# EAGLE design MICROCONTROLLER BOARD (EAGLE 9.6.2)
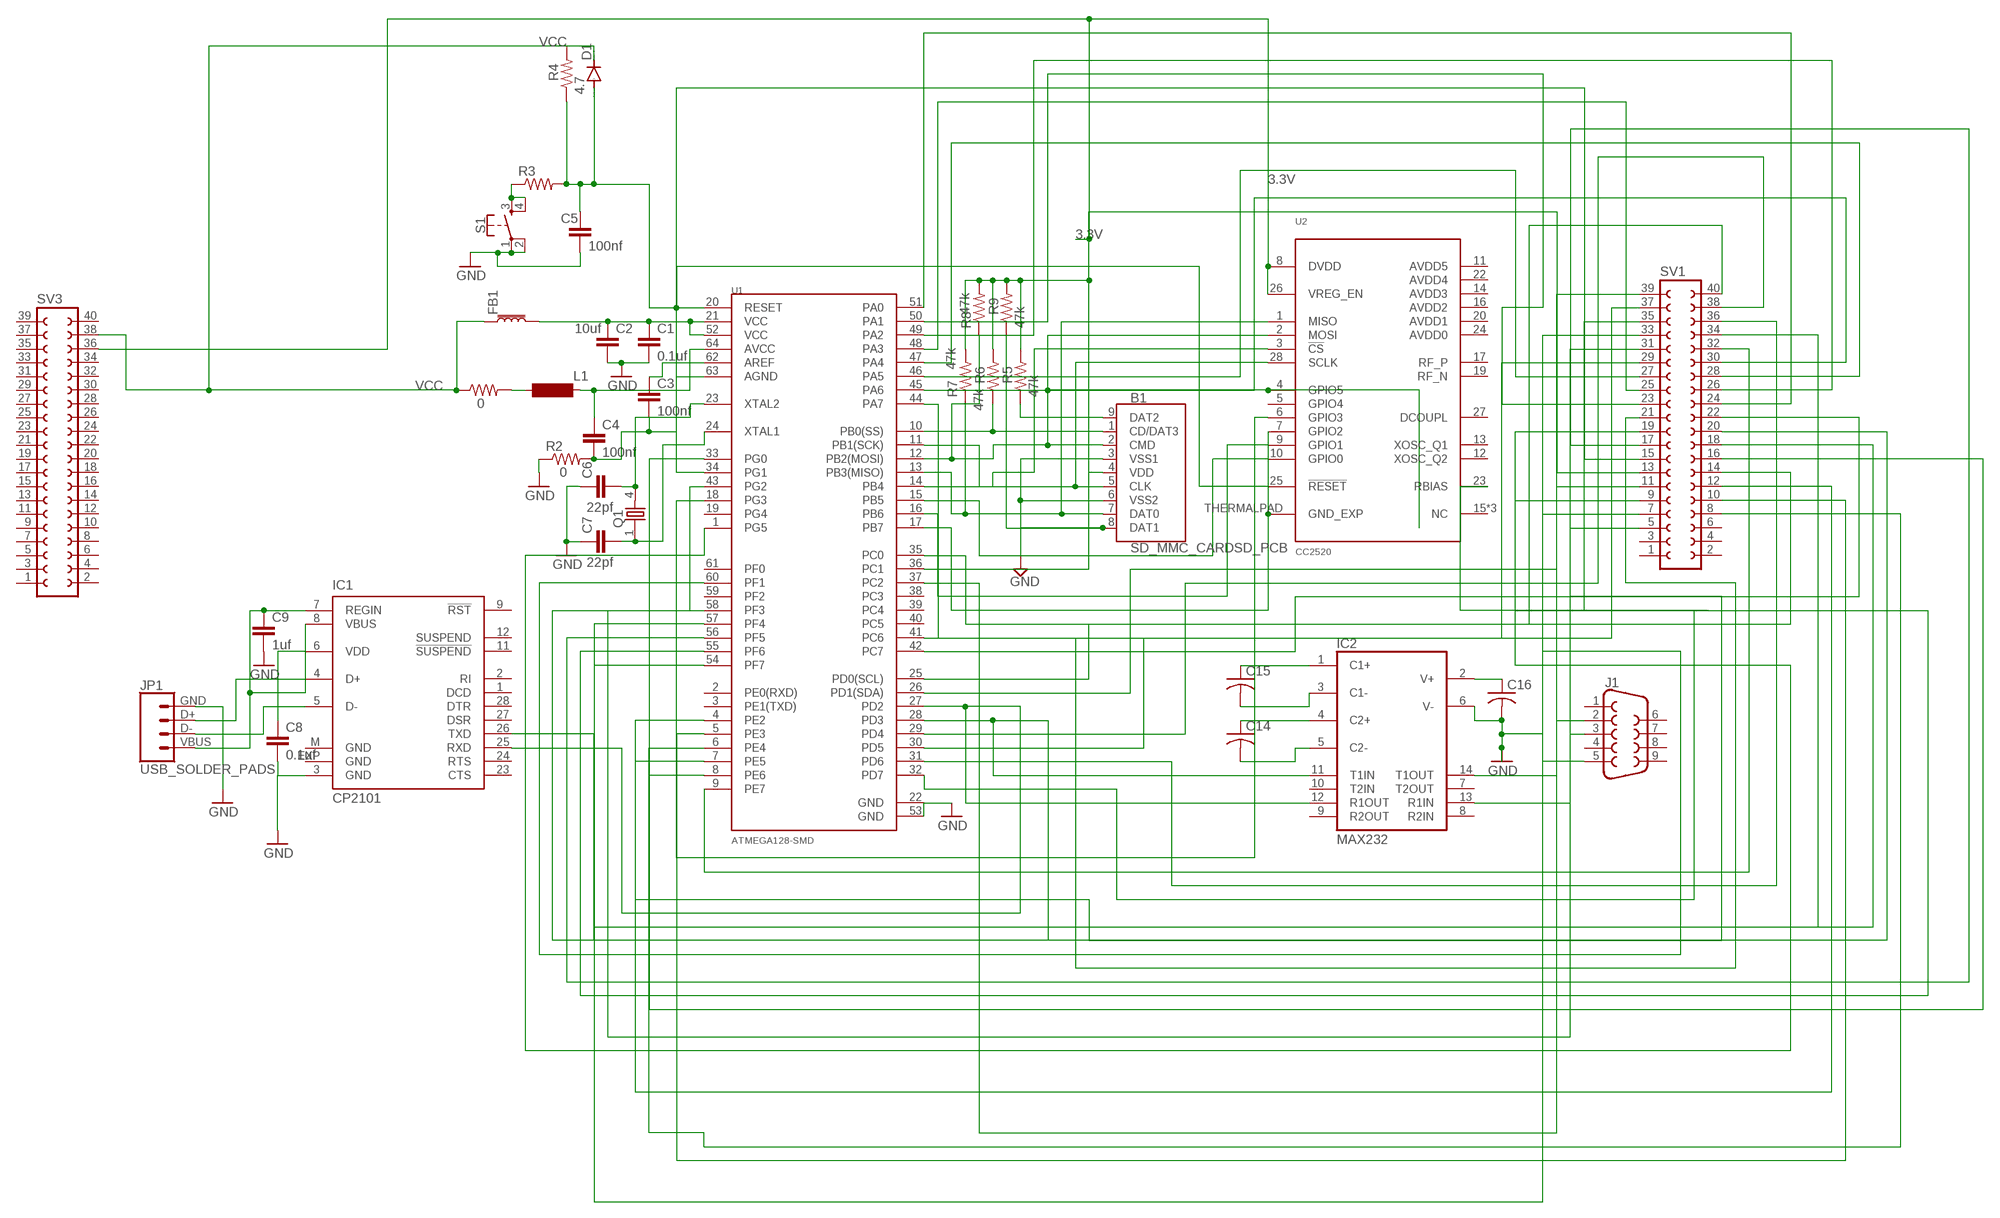
[diagram p0: schematic, sheet 1]

## Parts
B1  SD_MMC_CARDSD_PCB  [SD-MMC-CARD]
C1  0.1uf  C-EU025-024X044  [C025-024X044]
C2  10uf  C-EU025-024X044  [C025-024X044]
C3  100nf  C-EU025-024X044  [C025-024X044]
C4  100nf  C-EU025-024X044  [C025-024X044]
C5  100nf  C-EU025-024X044  [C025-024X044]
C6  22pf  C-EU025-024X044  [C025-024X044]
C7  22pf  C-EU025-024X044  [C025-024X044]
C8  0.1uf  C-EU025-024X044  [C025-024X044]
C9  1uf  C-EU025-024X044  [C025-024X044]
C14  C-US025-024X044  [C025-024X044]
C15  C-US025-024X044  [C025-024X044]
C16  C-US025-024X044  [C025-024X044]
D1  1N4004  [DO41-10]
FB1  FERRITE_BEAD-120_OHM-0402T  [0402-TIGHT]
IC1  CP2101  [MLP28]
IC2  MAX232  [DIL16]
J1  DB9FEMALE  [DB9]
JP1  USB_SOLDER_PADS  [USB-SOLDER-PADS]
L1  BS11  [BS11]
Q1  86SMX  [86SMX]
R1  0  R-US_0204/2V  [0204V]
R2  0  R-US_0204/2V  [0204V]
R3  R-US_0204/2V  [0204V]
R4  4.7  R-US_0204/2V  [0204V]
R5  47k  R-US_0204/2V  [0204V]
R6  47k  R-US_0204/2V  [0204V]
R7  47k  R-US_0204/2V  [0204V]
R8  47k  R-US_0204/2V  [0204V]
R9  47k  R-US_0204/2V  [0204V]
S1  MOMENTARY-SWITCH-SPST-2-SMD-4.6X2.8MM  [TACTILE_SWITCH_SMD_4.6X2.8MM]
SV1  FE20-2  [FE20-2]
SV3  FE20-2  [FE20-2]
U1  ATMEGA128-SMD  [TQFP64_14X14MM]
U2  CC2520  [S-PVQFN-N28]

## Nets
3.3V: B1.4(VDD) R5.2 R6.2 R7.2 R8.2 R9.2 SV3.36 U2.8(DVDD) U2.26(VREG_EN)
GND: B1.3(VSS1) B1.6(VSS2) C1.2 C2.2 C5.2 C6.1 C7.1 C8.2 C9.2 C16.2 IC1.3(GND) IC2.6(V-) J1.5 JP1.GND R2.1 S1.1 S1.2 U1.22(GND) U1.53(GND)
N$1: C1.1 C2.1 FB1.2 U1.21(VCC) U1.52(VCC)
N$2: L1.1 R1.2
N$3: C4.1 L1.2 U1.64(AVCC)
N$4: C3.1 U1.62(AREF)
N$5: C3.2 C4.2 R2.2 U1.63(AGND)
N$6: SV1.18 U1.54(PF7)
N$7: R3.1 S1.3 S1.4
N$8: C5.1 D1.A R3.2 R4.1 U1.20(RESET) U2.25(!RESET)
N$9: B1.8(DAT1) R9.1
N$10: SV1.40 U1.25(PD0(SCL))
N$11: C7.2 Q1.1 U1.24(XTAL1)
N$12: B1.7(DAT0) R7.1 U1.13(PB3(MISO)) U2.1(MISO)
N$13: B1.5(CLK) U1.11(PB1(SCK)) U2.28(SCLK)
N$14: B1.2(CMD) R8.1 U1.12(PB2(MOSI)) U2.2(MOSI) U2.4(GPIO5)
N$15: U1.16(PB6) U2.9(GPIO1)
N$16: B1.9(DAT2) R5.1
N$18: SV1.39 U1.26(PD1(SDA))
N$19: B1.1(CD/DAT3) R6.1 U1.10(PB0(SS))
N$20: U1.14(PB4) U2.3(!CS)
N$21: U1.15(PB5) U2.10(GPIO0)
N$22: U1.17(PB7) U2.7(GPIO2) U2.THERMALPAD(GND_EXP)
N$23: U1.18(PG3) U2.6(GPIO3)
N$24: SV1.38 U1.29(PD4)
N$25: SV1.37 U1.30(PD5)
N$26: IC1.26(TXD) IC2.11(T1IN) U1.28(PD3)
N$27: IC1.25(RXD) IC2.12(R1OUT) U1.27(PD2)
N$28: C9.1 IC1.7(REGIN) IC1.8(VBUS) JP1.VBUS
N$29: C15.1 IC2.1(C1+)
N$30: IC1.4(D+) JP1.D+
N$31: IC1.5(D-) JP1.D-
N$32: C15.2 IC2.3(C1-)
N$33: C8.1 IC1.6(VDD)
N$34: C14.1 IC2.4(C2+)
N$35: C14.2 IC2.5(C2-)
N$36: C16.1 IC2.2(V+)
N$37: SV1.36 U1.31(PD6)
N$38: IC2.14(T1OUT) J1.2
N$39: IC2.13(R1IN) J1.3
N$40: SV1.35 U1.32(PD7)
N$41: SV1.33 U1.60(PF1)
N$42: SV1.34 U1.8(PE6)
N$43: SV1.31 U1.7(PE5)
N$44: SV1.32 U1.9(PE7)
N$45: SV1.29 U1.44(PA7)
N$46: SV1.30 U1.45(PA6)
N$47: SV1.27 U1.46(PA5)
N$48: SV1.28 U1.47(PA4)
N$49: SV1.25 U1.48(PA3)
N$50: SV1.26 U1.49(PA2)
N$51: SV1.23 U1.50(PA1)
N$52: SV1.24 U1.51(PA0)
N$53: SV1.21 U1.41(PC6)
N$54: SV1.22 U1.42(PC7)
N$55: SV1.20 U1.43(PG2)
N$56: C6.2 Q1.4 U1.23(XTAL2)
N$57: SV1.16 U1.33(PG0)
N$58: SV1.17 U1.56(PF5)
N$59: SV1.19 U1.55(PF6)
N$60: SV1.15 U1.34(PG1)
N$61: SV1.14 U1.35(PC0)
N$62: SV1.13 U1.36(PC1)
N$63: U2.23(RBIAS)
N$64: SV1.9 U1.1(PG5)
N$65: SV1.12 U1.4(PE2)
N$66: SV1.10 U1.5(PE3)
N$67: SV1.11 U1.37(PC2)
N$68: SV1.7 U1.57(PF4)
N$69: SV1.5 U1.58(PF3)
N$70: SV1.8 U1.6(PE4)
VCC: D1.C FB1.1 R1.1 R4.2 SV3.38
Unconnected: IC1.1(DCD) IC1.2(RI) IC1.9(!RST) IC1.11(!SUSPEND) IC1.12(SUSPEND) IC1.23(CTS) IC1.24(RTS) IC1.27(DSR) IC1.28(DTR) IC2.7(T2OUT) IC2.8(R2IN) IC2.9(R2OUT) IC2.10(T2IN) J1.1 J1.4 J1.6 J1.7 J1.8 J1.9 SV1.1 SV1.2 SV1.3 SV1.4 SV1.6 SV3.1 SV3.2 SV3.3 SV3.4 SV3.5 SV3.6 SV3.7 SV3.8 SV3.9 SV3.10 SV3.11 SV3.12 SV3.13 SV3.14 SV3.15 SV3.16 SV3.17 SV3.18 SV3.19 SV3.20 SV3.21 SV3.22 SV3.23 SV3.24 SV3.25 SV3.26 SV3.27 SV3.28 SV3.29 SV3.30 SV3.31 SV3.32 SV3.33 SV3.34 SV3.35 SV3.37 SV3.39 SV3.40 U1.2(PE0(RXD)) U1.3(PE1(TXD)) U1.19(PG4) U1.38(PC3) U1.39(PC4) U1.40(PC5) U1.59(PF2) U1.61(PF0) U2.5(GPIO4) U2.11(AVDD5) U2.12(XOSC_Q2) U2.13(XOSC_Q1) U2.14(AVDD3) U2.15(NC) U2.16(AVDD2) U2.17(RF_P) U2.18(NC) U2.19(RF_N) U2.20(AVDD1) U2.21(NC) U2.22(AVDD4) U2.24(AVDD0) U2.27(DCOUPL)

## Power pins joined to a net without a drawn wire
GND: IC1.EXP(GND) IC1.M(GND) IC2.15(GND)
VCC: IC2.16(VCC)

## Library data of the parts
B1 = SparkFun-Boards:SD_MMC_CARD: SD MMC Card Footprint Mechanical footprint with connectors of an SD/MMC card- NOT a socket! SparkFun Products: Electric Imp <https://www.sparkfun.com/products/11395> microSD Card with SD adapter <https://www.sparkfun.com/products/13833>
C1-C9 = rcl:C-EU: CAPACITOR, European symbol; SPICEPREFIX: C
C14-C16 = rcl:C-US: CAPACITOR, American symbol; SPICEPREFIX: C
D1 = diode:1N4004: DIODE general purpose rectifier, 1 A
FB1 = SparkFun-Coils:FERRITE_BEAD-120_OHM: Ferrite Bead (blocks, cores, rings, chokes, etc.) Inductor with layers of ferrite used to suppress high frequencies. Often used to isolate high frequency noise.; PROD_ID: NDUC-14206
IC1 = silabs:CP210*: Single-Chip USB to UART Bridge Source: www.silabs.com .. CP2101.pdf / cp2102.pdf; MF: FARNELL; MPN: CP2102-GM; OC_FARNELL: 9282130; OC_NEWARK: 30K5635
IC2 = maxim:MAX232: RS232 TRANSCEIVER; MF: MAXIM; MPN: MAX232ACPE+; OC_FARNELL: 9723773; OC_NEWARK: 68K4544
J1 = SparkFun-Connectors:DB9: DB9 Connector Standard DB9 (D-Sub 9) serial connector. Can be used for CAN bus as well as RS485 and RS232. Footprint production proven. Here is the female version connector we sell at SparkFun: 9 Pin Female Serial Connector - PCB Mount <https://www.sparkfun.com/products/429> (PRT-00429) This connector has been used on the following SparkFun products: SparkFun RS232 Shifter - SMD <https://www.sparkfun.com/products/449> (PRT-00449) SparkFun RS232 Shifter SMD (No DB9) <https://www.sparkfun.com/products/8780> (PRT-08780); PROD_ID: CONN-08194
JP1 = SparkFun-Connectors:USB_SOLDER_PADS: Solder pad access to USB pins. Helpful to expose on PCBs so user can attach external USB connector if necessary.
L1 = inductor-neosid:BS: INDUCTOR nominal inductance, magnetically screened; OC_FARNELL: unknown; OC_NEWARK: unknown
Q1 = crystal:86SMX: CRYSTAL; MF: C-MAC FREQUENCY PRODUCTS LTD; MPN: XTAL003321- 86SMX; OC_FARNELL: 6344914; OC_NEWARK: 01H9866
R1-R9 = rcl:R-US_: RESISTOR, American symbol; SPICEPREFIX: R
S1 = SparkFun-Switches:MOMENTARY-SWITCH-SPST-2: Momentary Switch (Pushbutton) - SPST - Two Circuits Normally-open (NO) SPST momentary switches (buttons, pushbuttons). Schematic symbol includes two switch circuits. Variants SMD-4.6MMX2.8MM - 4.60mm x 2.80mm Tactile Momentary Button Switch - Used on SparkFun SAMD21 Mini Breakout <https://www.sparkfun.com/products/13664> SMD-5.2MM - Mini Pushbutton Switch - SMD <https://www.sparkfun.com/products/8720> - Used on Arduino Pro Mini <https://www.sparkfun.com/products/11114>; PROD_ID: SWCH-13065
SV1 SV3 = con-lsta:FE20-2: FEMALE HEADER; OC_FARNELL: unknown; OC_NEWARK: unknown
U1 = SparkFun-IC-Microcontroller:ATMEGA128: ATmega 128 ATmega128/128L/1281/2561. Note: The ATmega128 pin 1 is PEN and the ATmega256/1281 pin 1 is PG5. Not in catalog
U2 = CC2520:CC2520: 2.4 GHZ IEEE 802.15.4/ZIGBEE® RF TRANSCEIVER; AVAILABILITY: Unavailable; DESCRIPTION: IC RF TxRx + MCU 802.15.4 Zigbee® 2.4GHz 28-VFQFN Exposed Pad; MF: Texas Instruments; MP: CC2520; PACKAGE: VQFN-28 Texas Instruments; PRICE: None

## Board
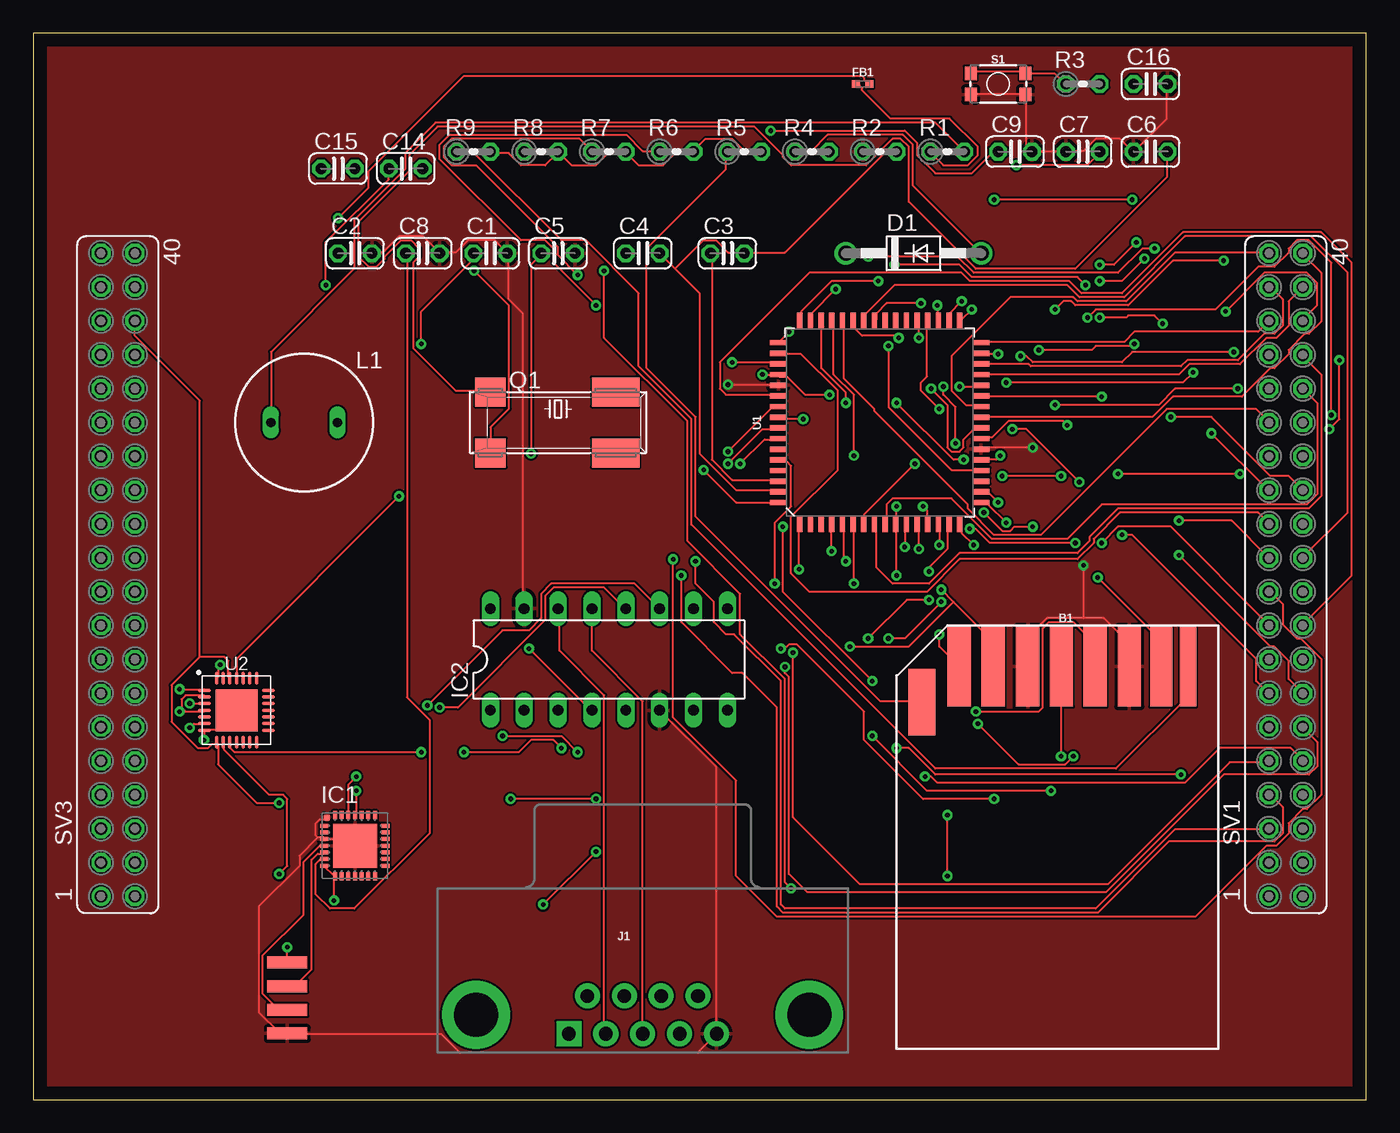
[diagram p1: board, top side]
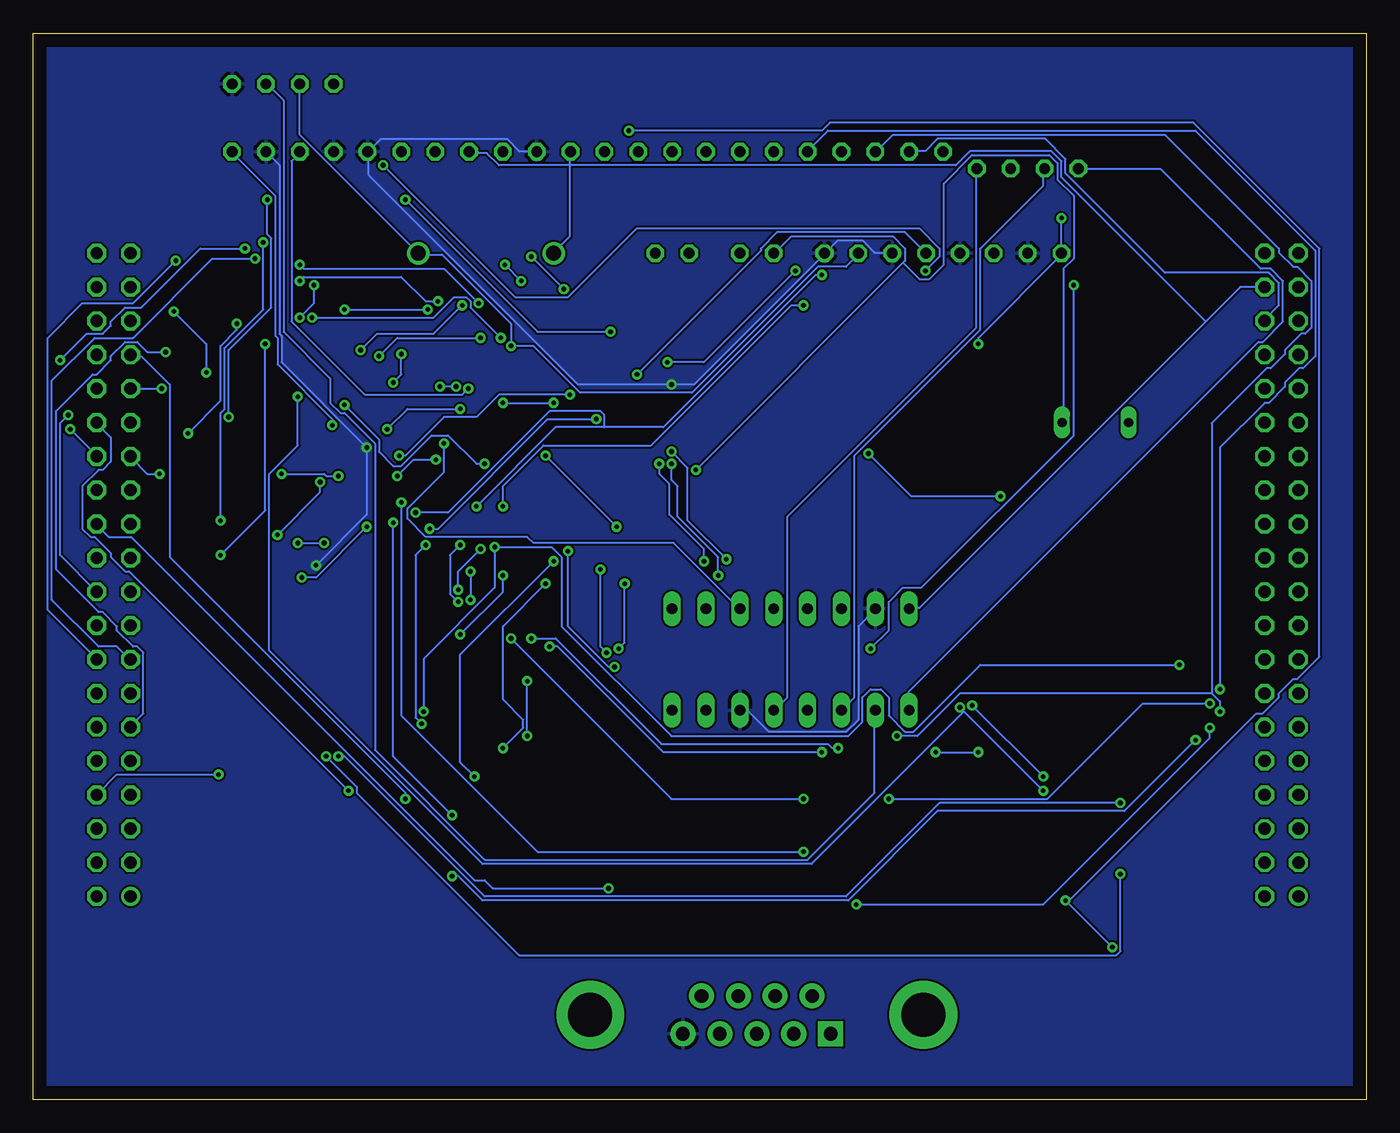
[diagram p2: board, bottom side, seen from below]

Size 100 x 80 mm. Coordinates in mm from the lower left corner, seen from the top.
Outline: 0,0 100,0 100,80 0,80 0,0
Copper layers (1*16): Top 0.035mm / dielectric 1.5mm / Bottom 0.035mm
Design rules "default": minimum track width 6mil, minimum drill 0.35mm, track to track 6mil, track to pad 6mil, pad to pad 6mil, via to via 6mil, smd to smd 6mil, copper to edge 40mil, drill to drill 6mil, minimum pad ring 10mil, minimum via ring 8mil, stop-mask expansion 4mil, vias tented up to drill 0mil, thermal gap 10mil

### Footprints (pad centres in the part's own frame; a part is rotated, then mirrored left to right if it is on the bottom)
SD-MMC-CARD = smd 1.75 x 6: 1 -8.015,14.713; 2 -5.465,14.703; 3 -2.87,14.703; 4 -0.34,14.703; 5 2.195,14.703; 6 4.76,14.703 | smd 1.65 x 6: 7 7.16,14.703 | smd 1.25 x 6: 8 9.16,14.703 | smd 2 x 5: 9 -10.8,12.03
C025-024X044 = drill 0.813 octagon: 1 -1.27,0; 2 1.27,0
DO41-10 = drill 1.118: A 5.08,0; C -5.08,0
0402-TIGHT = smd 0.6 x 0.6: 1 -0.5,0; 2 0.5,0
MLP28 = smd 0.6 x 0.3: 1 -2.3,1.5; 2 -2.3,1; 3 -2.3,0.5; 4 -2.3,0; 5 -2.3,-0.5; 6 -2.3,-1; 7 -2.3,-1.5; 15 2.3,-1.5; 16 2.3,-1; 17 2.3,-0.5; 18 2.3,0; 19 2.3,0.5; 20 2.3,1; 21 2.3,1.5 | smd 0.3 x 0.6: 8 -1.5,-2.3; 9 -1,-2.3; 10 -0.5,-2.3; 11 0,-2.3; 12 0.5,-2.3; 13 1,-2.3; 14 1.5,-2.3; 22 1.5,2.3; 23 1,2.3; 24 0.5,2.3; 25 0,2.3; 26 -0.5,2.3; 27 -1,2.3; 28 -1.5,2.3 | smd 3.3 x 3.3: EXP 0,0 | smd 0.435 x 0.435: M -2.103,2.103
DIL16 = drill 0.813 long: 1 -8.89,-3.81; 2 -6.35,-3.81; 3 -3.81,-3.81; 4 -1.27,-3.81; 5 1.27,-3.81; 6 3.81,-3.81; 7 6.35,-3.81; 8 8.89,-3.81; 9 8.89,3.81; 10 6.35,3.81; 11 3.81,3.81; 12 1.27,3.81; 13 -1.27,3.81; 14 -3.81,3.81; 15 -6.35,3.81; 16 -8.89,3.81
DB9 = drill 1.016 pad 1.88 square: 1 -5.54,-1.42 | drill 1.016 pad 1.88: 2 -2.77,-1.42; 3 0,-1.42; 4 2.77,-1.42; 5 5.54,-1.42; 6 -4.15,1.42; 7 -1.38,1.42; 8 1.38,1.42; 9 4.15,1.42 | drill 3.302 pad 5.08: G1 -12.5,0; G2 12.5,0
USB-SOLDER-PADS = smd 3 x 0.9: D+ 0,-0.889; D- 0,0.889; GND 0,-2.667; VBUS 0,2.667
BS11 = drill 0.7 long: 1 -2.5,0; 2 2.5,0
86SMX = smd 2.286 x 2.184: 1 -5.08,-2.286; 4 -5.08,2.286 | smd 3.556 x 2.184: 2 4.318,-2.286; 3 4.318,2.286
0204V = drill 0.813 octagon: 1 -1.27,0; 2 1.27,0
TACTILE_SWITCH_SMD_4.6X2.8MM = smd 0.9 x 1: 1 -2.05,-0.8; 2 2.05,-0.8; 3 2.05,0.8; 4 -2.05,0.8
FE20-2 = drill 0.914: 1 -24.13,1.27 | drill 0.914 octagon: 2 -24.13,-1.27; 3 -21.59,1.27; 4 -21.59,-1.27; 5 -19.05,1.27; 6 -19.05,-1.27; 7 -16.51,1.27; 8 -16.51,-1.27; 9 -13.97,1.27; 10 -13.97,-1.27; 11 -11.43,1.27; 12 -11.43,-1.27; 13 -8.89,1.27; 14 -8.89,-1.27; 15 -6.35,1.27; 16 -6.35,-1.27; 17 -3.81,1.27; 18 -3.81,-1.27; 19 -1.27,1.27; 20 -1.27,-1.27; 21 1.27,1.27; 22 1.27,-1.27; 23 3.81,1.27; 24 3.81,-1.27; 25 6.35,1.27; 26 6.35,-1.27; 27 8.89,1.27; 28 8.89,-1.27; 29 11.43,1.27; 30 11.43,-1.27; 31 13.97,1.27; 32 13.97,-1.27; 33 16.51,1.27; 34 16.51,-1.27; 35 19.05,1.27; 36 19.05,-1.27; 37 21.59,1.27; 38 21.59,-1.27; 39 24.13,1.27; 40 24.13,-1.27
TQFP64_14X14MM = smd 0.4 x 1.27: 1 -6,-7.6; 2 -5.2,-7.6; 3 -4.4,-7.6; 4 -3.6,-7.6; 5 -2.8,-7.6; 6 -2,-7.6; 7 -1.2,-7.6; 8 -0.4,-7.6; 9 0.4,-7.6; 10 1.2,-7.6; 11 2,-7.6; 12 2.8,-7.6; 13 3.6,-7.6; 14 4.4,-7.6; 15 5.2,-7.6; 16 6,-7.6; 33 6,7.6; 34 5.2,7.6; 35 4.4,7.6; 36 3.6,7.6; 37 2.8,7.6; 38 2,7.6; 39 1.2,7.6; 40 0.4,7.6; 41 -0.4,7.6; 42 -1.2,7.6; 43 -2,7.6; 44 -2.8,7.6; 45 -3.6,7.6; 46 -4.4,7.6; 47 -5.2,7.6; 48 -6,7.6 | smd 1.27 x 0.4: 17 7.6,-6; 18 7.6,-5.2; 19 7.6,-4.4; 20 7.6,-3.6; 21 7.6,-2.8; 22 7.6,-2; 23 7.6,-1.2; 24 7.6,-0.4; 25 7.6,0.4; 26 7.6,1.2; 27 7.6,2; 28 7.6,2.8; 29 7.6,3.6; 30 7.6,4.4; 31 7.6,5.2; 32 7.6,6; 49 -7.6,6; 50 -7.6,5.2; 51 -7.6,4.4; 52 -7.6,3.6; 53 -7.6,2.8; 54 -7.6,2; 55 -7.6,1.2; 56 -7.6,0.4; 57 -7.6,-0.4; 58 -7.6,-1.2; 59 -7.6,-2; 60 -7.6,-2.8; 61 -7.6,-3.6; 62 -7.6,-4.4; 63 -7.6,-5.2; 64 -7.6,-6
S-PVQFN-N28 = smd 1 x 0.28: 1 -2.4,1.5; 2 -2.4,1; 3 -2.4,0.5; 4 -2.4,0; 5 -2.4,-0.5; 6 -2.4,-1; 7 -2.4,-1.5; 15 2.4,-1.5; 16 2.4,-1; 17 2.4,-0.5; 18 2.4,0; 19 2.4,0.5; 20 2.4,1; 21 2.4,1.5 | smd 0.28 x 1: 8 -1.5,-2.4; 9 -1,-2.4; 10 -0.5,-2.4; 11 0,-2.4; 12 0.5,-2.4; 13 1,-2.4; 14 1.5,-2.4; 22 1.5,2.4; 23 1,2.4; 24 0.5,2.4; 25 0,2.4; 26 -0.5,2.4; 27 -1,2.4; 28 -1.5,2.4 | smd 3.15 x 3.15: THERMALPAD 0,0

### Placement (x,y rotation side)
B1  77.47,17.78 0 top
C1  34.29,63.5 0 top
C2  24.13,63.5 0 top
C3  52.07,63.5 0 top
C4  45.72,63.5 0 top
C5  39.37,63.5 0 top
C6  83.82,71.12 0 top
C7  78.74,71.12 0 top
C8  29.21,63.5 0 top
C9  73.66,71.12 0 top
C14  27.94,69.85 0 top
C15  22.86,69.85 0 top
C16  83.82,76.2 0 top
D1  66.04,63.5 0 top
FB1  62.23,76.2 0 top
IC1  24.13,19.05 0 top
IC2  43.18,33.02 0 top
J1  45.72,6.35 0 top
JP1  19.05,7.62 0 top
L1  20.32,50.8 0 top
Q1  39.37,50.8 0 top
R1  68.58,71.12 0 top
R2  63.5,71.12 0 top
R3  78.74,76.2 0 top
R4  58.42,71.12 0 top
R5  53.34,71.12 0 top
R6  48.26,71.12 0 top
R7  43.18,71.12 0 top
R8  38.1,71.12 0 top
R9  33.02,71.12 0 top
S1  72.39,76.2 0 top
SV1  93.98,39.37 90 top
SV3  6.35,39.37 90 top
U1  63.5,50.8 0 top
U2  15.24,29.21 0 top

### Tracks (layer width: path | path; a pad name or v marks a point on that pad's centre or on a via)
3.3V  (via drill 0.35)
  Top 0.152: R9.2 34.29,71.02 35.66,71.02 36.58,70.1 38.41,70.1 39.32,71.02 R8.2 40.39,70.1 42.22,70.1 43.13,71.02 44.35,71.02 R7.2 44.5,71.02 45.41,70.1 47.24,70.1 48.16,71.02 49.53,71.02 R6.2 49.53,71.17 50.44,72.08 52.43,72.08 53.34,71.17 54.56,71.17 R5.2 | 12.5,33.22 10.36,31.09 10.36,28.35 12.34,26.36 13.11,26.36 13.41,26.67 13.72,26.67 U2.8 13.87,26.67 13.87,25.15 16.76,22.25 v18.44,22.25 | 12.5,33.22 14.33,33.22 14.63,32.92 14.63,31.7 U2.26 | SV3.36 7.62,57.3 12.5,52.43 12.5,33.22 | v77.11,25.76 77.11,32.46 B1.4
  Bottom 0.152: v77.11,25.76 76.66,25.76 66.14,15.24 39.01,15.24 32,22.25 v18.44,22.25 | R9.2 34.29,71.17 33.07,71.17 32.16,72.08 24.08,72.08 22.55,70.56 22.55,69.49 15.09,62.03 7.32,62.03 6.55,61.27 6.55,59.59 7.62,58.52 SV3.36
GND  (via drill 0.35)
  Top 0.152: S1.1 70.41,75.44 74.37,75.44 S1.2 74.52,75.29 74.52,71.48 74.83,71.17 C9.2 74.98,71.17 77.42,71.17 C7.1 77.57,71.17 78.79,71.17 79.7,72.08 81.53,72.08 82.45,71.17 C6.1 85.04,73.61 85.04,76.2 C16.2 | 78.79,36.12 80.31,36.12 82.14,34.29 82.14,32.61 B1.6 | 78.79,36.12 76.05,36.12 74.68,34.75 74.68,32.61 B1.3 | v74.98,48.92 71.17,48.92 U1.22 | v78.79,40.08 78.79,36.12 | 30.48,63.55 29.26,64.77 27.43,64.77 26.21,63.55 25.45,63.55 C2.2 | v52.12,53.65 55.78,53.65 U1.53 | 30.48,63.55 31.7,63.55 32.61,64.47 34.59,64.47 C1.2 35.66,63.4 35.66,60.05 36.73,58.98 36.73,36.88 IC2.15 | 30.48,63.55 C8.2 | 21.34,19.66 21.18,19.81 21.18,20.73 21.49,21.03 21.95,21.03 IC1.M | 21.34,19.66 21.79,19.66 IC1.3 21.95,19.51 23.62,19.51 24.08,19.05 IC1.EXP | 21.34,19.66 19.96,18.29 19.96,17.53 16.92,14.48 16.92,6.55 18.44,5.03 19.05,5.03 JP1.GND 19.05,4.88 30.63,4.88 32,3.5 49.84,3.5 51.21,4.88 J1.5 51.21,5.03 51.21,24.99 IC2.6
  Bottom 0.152: R2.1 62.33,71.17 63.55,71.17 64.47,72.08 73.91,72.08 74.83,71.17 C9.2 74.83,71.02 74.83,69.34 59.13,53.65 v52.12,53.65 50.44,53.65 40.69,63.4 C5.2 40.54,63.55 39.62,64.47 37.8,64.47 36.88,63.55 35.66,63.55 C1.2 | C6.1 81.53,70.1 81.53,57.45 81.38,57.3 81.38,55.32 v74.98,48.92 74.98,43.89 v78.79,40.08 | IC2.6 46.94,29.11 46.33,29.11 44.81,27.58 39.01,27.58 38.1,28.5 38.1,35.51 36.88,36.73 IC2.15
  pour Bottom: -3.81,82.55 102.87,82.55 104.14,81.28 104.14,-2.54 -5.08,-2.54 -5.08,81.28
  pour Top: -8.89,83.82 -7.62,85.09 105.41,85.09 107.95,82.55 107.95,-6.35 -7.62,-6.35 -8.89,-5.08 -8.89,82.55
N$1  (via drill 0.35)
  Top 0.152: v72.54,48.31 72.24,48.01 71.17,48.01 U1.21 | v59.74,52.88 57.91,52.88 56.54,54.25 55.93,54.25 U1.52 55.78,54.41 v54.71,54.41 | v22.86,66.14 25.15,68.43 25.15,69.65 32.31,76.81 62.18,76.81 62.33,76.66 62.33,76.5 62.64,76.2 FB1.2 | v29.11,56.69 29.11,59.13 32.92,62.94 32.92,63.4 C1.1
  Bottom 0.152: v72.54,48.31 72.08,48.31 69.19,51.21 66.75,51.21 65.08,52.88 v59.74,52.88 | v22.86,66.14 C2.1 22.86,63.4 29.11,57.15 v29.11,56.69 | v54.71,54.41 45.41,63.7 45.41,63.86 44.2,65.08 34.59,65.08 C1.1
N$2
  Top 0.152: R1.2 67.67,73.3 30.18,73.3 27.89,71.02 27.89,69.8 24.08,65.99 24.08,62.33 17.83,56.08 17.83,50.9 L1.1
N$3  (via drill 0.35)
  Top 0.152: v50.29,47.24 52.73,44.81 55.78,44.81 U1.64
  Bottom 0.152: 34.75,62.79 34.59,62.94 34.59,63.86 35.51,64.77 43.13,64.77 44.35,63.55 C4.1 | 34.75,62.79 v50.29,47.24 | 34.75,62.79 33.53,61.57 32.77,61.57 31.7,62.64 31.7,68.73 29.57,70.87 23.77,70.87 23.16,70.26 23.16,69.04 21.95,67.82 21.95,63.09 22.71,62.33 22.71,50.9 L1.2
N$4
  Top 0.152: U1.62 55.78,46.48 52.43,46.48 50.9,48.01 50.9,63.4 C3.1
N$5
  Top 0.152: C4.2 48.16,62.33 | 48.16,62.33 49.99,60.5 49.99,48.46 52.73,45.72 55.78,45.72 U1.63 | 53.34,63.55 52.12,63.55 51.21,64.47 50.29,64.47 48.16,62.33 | 53.34,63.55 56.39,63.55 63.86,71.02 64.77,71.02 R2.2 | 53.34,63.55 C3.2
N$6
  Top 0.152: U1.54 55.78,52.88 51.97,52.88 51.51,53.34 51.51,55.32 58.22,62.03 69.65,62.03 70.26,61.42 77.72,61.42 78.64,60.5 81.69,60.5 86.26,65.08 96.62,65.08 98.91,62.79 98.91,39.32 95.25,35.66 SV1.18
N$7
  Top 0.152: S1.4 70.41,77.11 74.37,77.11 S1.3 74.52,76.96 76.66,76.96 77.42,76.2 R3.1
N$8  (via drill 0.35)
  Top 0.152: v64.16,56.54 64.16,51.97 68.89,47.24 71.02,47.24 U1.20 | R4.1 57.15,71.17 58.37,71.17 59.59,72.39 65.23,72.39 65.99,71.63 65.99,68.58 71.02,63.55 D1.A | U2.25 15.24,33.07 v27.43,45.26 | v37.34,48.46 37.34,62.64 38.1,63.4 C5.1
  Bottom 0.152: R3.2 80.01,72.39 D1.A 71.02,63.4 69.34,63.4 64.16,58.22 v64.16,56.54 62.48,56.54 58.98,53.03 50.6,53.03 41.15,62.48 39.01,62.48 38.1,63.4 C5.1 | v27.43,45.26 34.14,45.26 v37.34,48.46
N$9
  Top 0.152: R9.1 31.85,71.02 33.07,71.02 39.62,64.47 41.45,64.47 45.41,60.5 45.41,55.02 49.38,51.05 49.38,43.13 67.67,24.84 81.23,24.84 86.56,30.18 86.56,32.46 B1.8
N$10
  Top 0.152: U1.25 71.17,51.21 83.97,51.21 85.5,52.73 90.68,52.73 92.81,54.86 93.12,54.86 94.18,55.93 94.18,56.24 95.4,57.45 95.71,57.45 96.62,58.37 96.62,62.03 95.25,63.4 SV1.40
N$11  (via drill 0.35)
  Top 0.152: v67.36,53.34 68.58,52.12 68.58,48.92 68.89,48.62 69.49,48.62 69.8,48.92 69.8,49.53 70.56,50.29 71.02,50.29 U1.24 | Q1.1 34.29,50.44 35.66,51.82 35.66,59.59 v33.07,62.18 | v73.76,70.1 79.1,70.1 80.01,71.02 C7.2
  Bottom 0.152: v67.36,53.34 67.82,52.88 75.13,52.88 80.62,58.37 80.62,70.41 80.01,71.02 C7.2 | v33.07,62.18 32,63.25 32,63.86 33.53,65.38 54.71,65.38 59.89,60.2 63.86,60.2 v73.76,70.1
N$12  (via drill 0.35)
  Top 0.152: v10.97,30.79 12.8,30.79 U2.1 | v66.75,44.5 67.06,44.2 67.06,43.28 U1.13 | v40.84,61.87 39.32,63.4 39.32,64.01 33.22,70.1 31.39,70.1 30.79,70.71 30.79,71.48 31.39,72.08 41,72.08 41.91,71.17 R7.1 | v79.86,39.17 84.58,34.44 84.58,32.61 B1.7 | v74.98,42.98 73.61,42.98 73.3,42.67 72.69,42.67 v71.32,44.04
  Bottom 0.152: v10.97,30.79 10.97,48.92 7.62,52.27 7.32,52.27 6.1,53.49 6.1,53.8 5.03,54.86 4.72,54.86 3.81,55.78 3.81,63.7 12.8,72.69 40.39,72.69 41.91,71.17 R7.1 | v66.75,44.5 60.81,50.44 57.15,50.44 | 57.15,50.44 52.73,50.44 41.3,61.87 v40.84,61.87 | v79.86,39.17 78.79,39.17 v74.98,42.98 | v71.32,44.04 68.89,44.04 61.27,51.66 57.45,51.66 57.15,51.36 57.15,50.44
N$13  (via drill 0.35)
  Top 0.152: v14.02,32.61 13.87,32.46 13.87,31.7 U2.28 | v65.38,41.45 65.38,43.13 U1.11 | v70.71,29.11 75.44,29.11 75.74,29.41 75.74,35.36 76.2,35.81 78.03,35.81 79.55,34.29 79.55,32.61 B1.5
  Bottom 0.152: v14.02,32.61 28.96,32.61 33.98,27.58 34.59,27.58 35.81,28.8 35.81,30.18 36.42,30.79 37.19,30.79 37.8,30.18 37.8,28.35 38.86,27.28 52.12,27.28 60.35,35.51 60.35,40.69 61.11,41.45 v65.38,41.45 65.38,38.41 70.71,33.07 v70.71,29.11
N$14  (via drill 0.35)
  Top 0.152: v66.45,41.3 66.45,43.13 U1.12 | 69.04,37.34 71.93,34.44 71.93,32.61 B1.2 | 69.04,37.34 v68.12,38.25 | 11.28,29.26 11.12,29.41 11.12,30.02 11.43,30.33 12.8,30.33 U2.2 | 11.28,29.26 11.43,29.11 12.8,29.11 U2.4 | 11.28,29.26 11.12,29.26 v10.97,29.11 | 69.04,37.34 65.68,33.98 v61.27,33.98 | v40.84,26.06 39.62,27.28 v35.2,27.28
  Bottom 0.152: v66.45,41.3 68.12,39.62 v68.12,38.25 | v10.97,29.11 10.97,29.87 11.58,30.48 | 11.58,30.48 11.58,50.75 7.47,54.86 7.16,54.86 6.1,55.93 6.1,56.24 4.88,57.45 4.57,57.45 4.12,57.91 4.12,61.42 5.18,62.48 5.49,62.48 6.55,63.55 6.55,63.86 15.09,72.39 35.51,72.39 36.73,71.17 R8.1 | v61.27,33.98 60.66,33.98 52.73,26.06 v40.84,26.06 | v35.2,27.28 33.68,27.28 30.48,30.48 11.58,30.48
N$15  (via drill 0.35)
  Top 0.152: v18.44,16.92 19.05,17.53 19.05,22.55 18.75,22.86 17.68,22.86 14.33,26.21 14.33,26.67 U2.9 | v78.03,25.76 77.42,25.15 73.91,25.15 v70.87,28.19 | v70.56,41.6 69.65,42.52 69.65,43.13 U1.16
  Bottom 0.152: v18.44,16.92 18.44,11.12 18.75,10.82 63.55,10.82 75.74,23.01 75.74,23.47 v78.03,25.76 | v70.87,28.19 71.32,28.65 71.32,40.84 v70.56,41.6
N$16
  Top 0.152: R5.1 51.97,71.02 51.97,69.8 46.02,63.86 46.02,54.86 49.68,51.21 49.68,43.74 63.55,29.87 66.6,29.87 B1.9
N$18
  Top 0.152: U1.26 71.02,52.12 69.95,52.12 68.89,53.19 68.89,55.78 73.3,60.2 78.03,60.2 78.33,59.89 81.99,59.89 85.65,63.55 92.66,63.55 SV1.39
N$19  (via drill 0.35)
  Top 0.152: v64.77,39.32 64.77,43.13 U1.10 64.77,43.28 v64.77,44.5 | v67.97,34.9 67.97,33.98 69.34,32.61 B1.1 | v42.22,59.59 39.01,62.79 39.01,63.86 38.41,64.47 36.58,64.47 30.48,70.56 30.48,71.63 31.24,72.39 44.5,72.39 45.72,71.17 46.94,71.17 R6.1
  Bottom 0.152: v64.77,39.32 64.77,38.1 v67.97,34.9 | v42.22,59.59 43.13,59.59 53.65,49.07 61.72,49.07 64.77,46.02 v64.77,44.5
N$20  (via drill 0.35)
  Top 0.152: v11.73,29.72 12.8,29.72 U2.3 | v42.22,22.55 v35.81,22.55 | v64.16,34.59 65.38,34.59 v68.12,37.34 | v67.97,41.6 67.97,43.13 U1.14
  Bottom 0.152: v11.73,29.72 16.76,29.72 23.93,22.55 v35.81,22.55 | v42.22,22.55 52.12,22.55 v64.16,34.59 | v68.12,37.34 68.73,37.95 68.73,40.84 v67.97,41.6
N$21  (via drill 0.35)
  Top 0.152: v29.11,26.06 15.09,26.06 14.78,26.36 14.78,26.67 U2.10 | v32.31,26.06 36.42,26.06 37.34,26.98 39.01,26.98 v39.62,26.36 | v62.64,34.59 65.53,37.49 v67.21,37.49 | v67.21,39.62 67.21,39.93 68.58,41.3 68.58,43.13 U1.15
  Bottom 0.152: v32.31,26.06 v29.11,26.06 | v39.62,26.36 40.08,26.36 40.39,26.67 52.88,26.67 60.81,34.59 v62.64,34.59 | v67.21,39.62 v67.21,37.49
N$22  (via drill 0.35)
  Top 0.152: U2.THERMALPAD 15.24,29.11 13.87,27.74 12.95,27.74 U2.7 12.8,27.58 v12.8,26.98 | v73,43.28 71.63,44.65 71.17,44.65 U1.17 | v68.58,16.76 v68.58,21.34
  Bottom 0.152: v73,43.28 73,25.76 v68.58,21.34 | v68.58,16.76 68.12,16.76 66.29,14.94 38.86,14.94 32.16,21.64 18.14,21.64 v12.8,26.98
N$23  (via drill 0.35)
  Top 0.152: v11.73,27.89 12.04,28.19 12.8,28.19 U2.6 | v42.22,18.59 v38.25,14.63 | v72.39,44.81 71.63,45.57 71.17,45.57 U1.18
  Bottom 0.152: v11.73,27.89 11.73,27.13 24.23,14.63 v38.25,14.63 | v42.22,18.59 62.18,18.59 72.39,28.8 v72.39,44.81
N$24
  Top 0.152: SV1.38 94.18,59.89 94.18,58.06 93.27,57.15 92.51,57.15 90.53,55.17 86.72,55.17 85.95,54.41 71.17,54.41 U1.29
N$25
  Top 0.152: U1.30 71.17,55.17 74.68,55.17 74.83,55.02 86.11,55.02 86.56,55.47 90.37,55.47 92.35,57.45 93.12,57.45 93.73,58.06 93.73,60.05 92.81,60.96 SV1.37
N$26  (via drill 0.35)
  Top 0.152: v24.23,24.23 23.62,23.62 23.62,21.49 IC1.26 | v29.57,29.57 35.2,35.2 37.19,35.2 38.1,36.12 38.1,37.95 38.86,38.71 45.11,38.71 IC2.11 | v69.49,53.49 71.02,53.49 U1.28 | v68.28,53.49 68.28,52.88 69.19,51.97 v69.19,49.23
  Bottom 0.152: v29.57,29.57 v24.23,24.23 | v68.28,53.49 v69.49,53.49 | v69.19,49.23 69.19,47.09 71.93,44.35 71.93,43.59 70.56,42.22 62.94,42.22 62.48,41.76 51.97,41.76 47.09,36.88 IC2.11
N$27  (via drill 0.35)
  Top 0.152: v24.23,23.16 24.23,21.49 IC1.25 | v30.48,29.41 31.85,29.41 38.41,35.97 38.41,37.8 39.01,38.41 42.82,38.41 44.35,36.88 IC2.12 | v80.16,52.73 71.17,52.73 U1.27
  Bottom 0.152: v30.48,29.41 30.18,29.11 | 30.18,29.11 v24.23,23.16 | v80.16,52.73 80.16,49.07 82.3,46.94 82.3,33.68 66.29,17.68 41.6,17.68 30.18,29.11
N$28  (via drill 0.35)
  Top 0.152: IC1.7 21.79,17.53 22.55,16.76 IC1.8 22.55,16.61 v22.55,14.94 | JP1.VBUS v19.05,11.43 | v55.32,72.69 65.38,72.69 66.29,71.78 66.29,70.87 67.67,69.49 70.41,69.49 71.93,71.02 72.39,71.02 C9.1
  Bottom 0.152: v19.05,11.43 22.4,14.78 | v55.32,72.69 40.84,72.69 40.23,73.3 12.95,73.3 3.5,63.86 3.5,33.22 5.18,31.55 5.49,31.55 6.55,30.48 6.55,30.18 7.77,28.96 8.23,28.96 22.4,14.78 | 22.4,14.78 v22.55,14.94
N$29
  Bottom 0.152: IC2.1 34.29,30.63 8.08,56.84 7.77,56.84 6.25,58.37 6.25,61.42 7.16,62.33 7.92,62.33 15.39,69.8 21.49,69.8 C15.1
N$30
  Top 0.152: IC1.4 21.49,19.05 20.27,17.83 20.27,13.87 17.22,10.82 17.22,7.92 18.29,6.86 19.05,6.86 JP1.D+
N$31
  Top 0.152: IC1.5 21.79,18.44 21.34,18.44 20.88,17.98 20.88,9.75 19.66,8.53 19.05,8.53 JP1.D-
N$32
  Bottom 0.152: IC2.3 38.41,30.18 38.41,48.31 28.96,57.76 28.96,63.86 24.23,68.58 24.23,69.8 C15.2
N$33
  Top 0.152: IC1.6 21.79,17.98 21.49,17.98 21.18,17.68 21.18,15.39 22.25,14.33 24.08,14.33 29.72,19.96 29.72,28.5 28.04,30.18 28.04,63.4 C8.1
N$34  (via drill 0.35)
  Top 0.152: C14.1 26.67,69.04 21.95,64.31 v21.95,61.11 | v37.19,33.83 41.91,29.11 IC2.4
  Bottom 0.152: v21.95,61.11 21.95,49.84 33.38,38.41 34.75,38.41 35.81,37.34 35.81,35.2 v37.19,33.83
N$35
  Bottom 0.152: C14.2 29.26,69.8 29.26,57.91 43.43,43.74 43.43,30.18 44.35,29.26 IC2.5
N$36
  Bottom 0.152: IC2.2 36.88,29.11 36.88,23.01 41.91,17.98 66.14,17.98 74.37,26.21 74.37,49.23 76.66,51.51 76.96,51.51 77.72,52.27 77.72,54.1 81.23,57.61 81.23,74.98 82.45,76.2 C16.1
N$37  (via drill 0.35)
  Top 0.152: v72.39,55.93 71.17,55.93 U1.31 | v73,53.8 86.26,53.8 v87.02,54.56 | v89.46,59.13 92.35,62.03 95.56,62.03 96.32,61.27 96.32,59.59 95.25,58.52 SV1.36
  Bottom 0.152: v72.39,55.93 72.39,54.41 v73,53.8 | v87.02,54.56 87.02,56.69 v89.46,59.13
N$38
  Top 0.152: IC2.14 39.47,36.73 39.47,33.68 42.82,30.33 42.82,5.03 J1.2
N$39
  Top 0.152: IC2.13 41.91,33.68 45.72,29.87 J1.3
N$40
  Top 0.152: SV1.35 91.9,57.61 82.6,57.61 81.84,56.84 71.17,56.84 U1.32
N$41  (via drill 0.35)
  Top 0.152: v55.63,38.71 55.63,43.28 56.84,44.5 56.84,47.55 56.54,47.85 55.93,47.85 U1.60 | v56.08,33.83 56.39,33.83 56.69,34.14 57.3,34.14 62.33,29.11 62.33,26.98 66.75,22.55 v72.08,22.55
  Bottom 0.152: v55.63,38.71 55.63,34.29 v56.08,33.83 | v72.08,22.55 72.08,23.01 89.76,40.69 89.76,53.65 91.9,55.78 92.66,55.78 SV1.33
N$42
  Top 0.152: U1.8 63.25,43.13 63.25,39.93 64.47,38.71 67.21,38.71 69.49,41 78.33,41 79.25,41.91 79.25,42.22 81.38,44.35 95.71,44.35 96.62,45.26 96.62,54.41 95.25,55.78 SV1.34
N$43  (via drill 0.35)
  Top 0.152: v66.14,47.7 62.33,43.89 62.33,43.28 U1.7 | v76.66,52.12 84.43,52.12 85.65,53.34 v90.37,53.34
  Bottom 0.152: v66.14,47.7 66.75,47.7 68.89,49.84 70.1,49.84 72.39,47.55 73,47.55 74.07,48.62 74.07,49.53 v76.66,52.12 | SV1.31 v90.37,53.34
N$44
  Top 0.152: SV1.32 96.32,52.27 96.32,45.41 95.56,44.65 80.16,44.65 77.57,42.06 71.93,42.06 68.89,45.11 64.47,45.11 64.01,44.65 64.01,43.28 U1.9
N$45
  Top 0.152: U1.44 60.81,58.37 60.81,54.1 63.09,51.82 63.09,51.66 70.1,44.65 70.1,44.35 72.08,42.37 75.59,42.37 85.04,51.82 91.75,51.82 92.66,50.9 SV1.29
N$46  (via drill 0.35)
  Top 0.152: v61.57,48.31 61.57,52.88 60.05,54.41 60.05,58.37 U1.45 | v56.24,42.98 56.24,38.1 v62.94,31.39 | v62.94,27.28 67.06,23.16 v76.35,23.16
  Bottom 0.152: v56.24,42.98 v61.57,48.31 | v62.94,27.28 v62.94,31.39 | v76.35,23.16 92.81,39.62 93.12,39.62 94.18,40.69 94.18,41 95.4,42.22 95.71,42.22 96.32,42.82 96.32,46.02 95.1,47.24 94.79,47.24 94.18,47.85 94.18,49.68 95.25,50.75 SV1.30
N$47  (via drill 0.35)
  Top 0.152: v60.96,52.27 60.96,53.03 59.13,54.86 59.13,58.37 U1.46 | v64.77,52.27 69.04,48.01 v69.8,48.01 | v77.11,46.79 v72.69,46.79 | v90.53,46.94 v81.38,46.94
  Bottom 0.152: v64.77,52.27 v60.96,52.27 | v69.8,48.01 71.48,48.01 v72.69,46.79 | v77.11,46.79 78.03,46.79 78.18,46.94 v81.38,46.94 | v90.53,46.94 91.44,46.94 92.66,48.16 SV1.27
N$48  (via drill 0.35)
  Top 0.152: v60.2,60.81 58.37,58.98 58.37,58.52 U1.47 | v62.64,63.25 69.34,63.25 70.56,62.03 81.38,62.03 83.21,63.86 v84.12,63.86 | v97.99,55.47 97.99,51.05 v97.23,50.29
  Bottom 0.152: v62.64,63.25 v60.2,60.81 | v84.12,63.86 87.48,63.86 91.9,59.44 93.12,59.44 94.18,58.37 94.18,58.06 94.79,57.45 96.01,57.45 v97.99,55.47 | v97.23,50.29 95.25,48.31 SV1.28
N$49  (via drill 0.35)
  Top 0.152: v63.4,61.42 59.89,61.42 57.61,59.13 57.61,58.52 U1.48 | v64.62,62.64 69.49,62.64 70.41,61.72 78.33,61.72 v78.94,61.11 | v80.01,58.67 81.99,58.67 82.14,58.83 84.12,58.83 v84.73,58.22 | v88.39,49.99 92.66,45.72 SV1.25
  Bottom 0.152: v64.62,62.64 v63.4,61.42 | v78.94,61.11 78.94,59.74 v80.01,58.67 | v84.73,58.22 84.73,57.76 85.95,56.54 85.95,52.43 v88.39,49.99
N$50  (via drill 0.35)
  Top 0.152: v56.69,57.61 55.93,56.84 U1.49 | v82.45,67.51 v72.08,67.51 | v85.34,51.21 88.39,51.21 92.81,46.79 94.18,46.79 SV1.26
  Bottom 0.152: v56.69,57.61 62.18,57.61 v72.08,67.51 | v82.45,67.51 82.45,64.92 82.14,64.62 82.14,59.44 85.34,56.24 v85.34,51.21
N$51
  Top 0.152: U1.50 55.93,55.93 57.61,55.93 60.35,53.19 60.35,47.24 56.84,43.74 56.84,39.47 58.22,38.1 67.06,38.1 69.49,40.54 78.33,40.54 79.55,41.76 79.55,42.06 81.53,44.04 91.9,44.04 92.66,43.28 SV1.23
N$52  (via drill 0.35)
  Top 0.152: v52.43,55.32 55.78,55.32 U1.51 | v42.82,62.18 42.82,57.15 49.07,50.9 49.07,41.91 53.03,37.95 53.03,34.9 56.39,31.55 56.39,16.31 v56.84,15.85
  Bottom 0.152: v52.43,55.32 49.68,55.32 v42.82,62.18 | v56.84,15.85 65.53,15.85 66.14,16.46 66.9,16.46 92.66,42.22 94.34,42.22 95.25,43.13 SV1.24
N$53  (via drill 0.35)
  Top 0.152: v66.6,59.74 64.01,59.74 63.25,58.98 63.25,58.52 U1.41 | v80.01,62.64 81.08,62.64 v82.75,64.31 | v85.95,43.43 89.92,43.43 SV1.21
  Bottom 0.152: v66.6,59.74 69.19,62.33 79.7,62.33 v80.01,62.64 | v82.75,64.31 82.75,59.28 85.65,56.39 85.65,51.82 85.95,51.51 v85.95,43.43
N$54
  Top 0.152: U1.42 62.33,58.52 62.33,58.83 64.62,61.11 77.57,61.11 78.49,60.2 81.84,60.2 86.41,64.77 95.86,64.77 98.6,62.03 98.6,44.04 95.25,40.69 SV1.22
N$55  (via drill 0.35)
  Top 0.152: v64.92,57.15 64.77,57.3 62.18,57.3 61.57,57.91 61.57,58.37 U1.43 | v79.1,58.67 79.7,59.28 88.7,59.28 91.9,62.48 93.12,62.48 94.18,63.55 94.18,63.86 94.79,64.47 95.71,64.47 97.38,62.79 v97.38,51.36
  Bottom 0.152: v64.92,57.15 67.21,59.44 67.21,59.89 67.51,60.2 68.43,60.2 69.95,58.67 v79.1,58.67 | v97.38,51.36 97.99,50.75 97.99,40.84 SV1.20
N$56  (via drill 0.35)
  Top 0.152: v77.57,50.6 77.27,50.9 73.15,50.9 71.93,49.68 71.17,49.68 U1.23 | Q1.4 34.29,53.19 31.7,53.19 28.5,56.39 28.5,62.79 28.96,63.25 28.96,63.86 28.35,64.47 27.58,64.47 26.36,63.25 26.36,63.09 25.76,62.48 25.15,62.48 24.38,63.25 24.38,65.84 28.19,69.65 28.19,70.87 30.33,73 54.1,73 56.24,70.87 56.24,70.71 56.84,70.1 62.48,70.1 64.47,72.08 65.08,72.08 65.68,71.48 65.68,67.36 70.71,62.33 78.18,62.33 85.04,69.19 85.04,71.02 C6.2
  Bottom 0.152: v77.57,50.6 77.57,51.05 81.69,55.17 81.69,57.15 81.84,57.3 81.84,67.82 85.04,71.02 C6.2
N$57  (via drill 0.35)
  Top 0.152: v70.41,59.28 69.65,58.52 U1.33 | v76.66,59.28 77.27,59.89 77.88,59.89 78.18,59.59 82.14,59.59 85.5,62.94 v89.31,62.94
  Bottom 0.152: v76.66,59.28 v70.41,59.28 | v89.31,62.94 92.51,59.74 96.32,59.74 98.91,57.15 98.91,36.73 95.25,33.07 SV1.16
N$58  (via drill 0.35)
  Top 0.152: v57.76,51.05 55.93,51.05 U1.56 | v70.26,42.82 70.71,42.82 71.78,41.76 v78.18,41.76 | v80.16,41.76 81.38,42.98 85.34,42.98 92.66,35.66 SV1.17
  Bottom 0.152: v57.76,51.05 61.42,51.05 69.65,42.82 v70.26,42.82 | v80.16,41.76 v78.18,41.76
N$59  (via drill 0.35)
  Top 0.152: v52.12,48.62 55.47,51.97 55.78,51.97 U1.55 | v48.01,40.54 48.01,28.65 52.73,23.93 52.73,16.76 55.78,13.72 87.17,13.72 92.51,19.05 93.27,19.05 94.18,19.96 94.18,20.73 95.25,21.79 95.56,21.79 96.62,22.86 96.62,33.07 95.1,34.59 94.79,34.59 93.73,35.66 93.73,37.19 92.81,38.1 SV1.19
  Bottom 0.152: v52.12,48.62 50.9,47.4 50.9,43.43 v48.01,40.54
N$60  (via drill 0.35)
  Top 0.152: v69.65,59.89 68.73,58.98 68.73,58.52 U1.34 | v80.01,61.42 81.69,61.42 v83.36,63.09
  Bottom 0.152: v69.65,59.89 70.56,59.89 72.39,61.72 79.7,61.72 v80.01,61.42 | v83.36,63.09 86.56,63.09 92.51,57.15 95.4,57.15 98.6,53.95 98.6,37.49 95.1,33.98 93.73,33.98 92.81,33.07 SV1.15
N$61  (via drill 0.35)
  Top 0.152: v67.82,59.59 67.82,58.52 U1.35 | v75.44,56.24 79.4,56.24 79.7,56.54 82.45,56.54 v82.6,56.69 | v85.95,40.84 92.81,33.98 93.12,33.98 94.18,32.92 94.18,31.55 SV1.14
  Bottom 0.152: v67.82,59.59 69.95,57.45 74.22,57.45 v75.44,56.24 | v82.6,56.69 82.6,44.2 v85.95,40.84
N$62  (via drill 0.35)
  Top 0.152: v67.97,51.82 66.6,53.19 66.6,53.8 67.06,54.25 67.06,58.37 U1.36 | v73.46,50.29 74.52,50.29 v78.49,46.33 | v81.69,42.37 82.45,42.37 91.75,33.07 91.75,31.39 92.66,30.48 SV1.13
  Bottom 0.152: v67.97,51.82 71.93,51.82 v73.46,50.29 | v78.49,46.33 78.49,45.57 v81.69,42.37
N$64  (via drill 0.35)
  Top 0.152: v57.45,39.78 57.45,43.13 U1.1 | v57,33.53 57,21.18 62.03,16.15 80.62,16.15 89.76,25.3 92.66,25.3 SV1.9
  Bottom 0.152: v57.45,39.78 57.45,33.98 v57,33.53
N$65  (via drill 0.35)
  Top 0.152: v59.89,41.15 59.89,43.13 U1.4 | v56.39,32.46 56.39,32 56.69,31.7 56.69,16.92 58.06,15.54 80.47,15.54 89.31,24.38 95.71,24.38 96.32,24.99 96.32,26.82 95.25,27.89 SV1.12
  Bottom 0.152: v59.89,41.15 59.89,35.51 56.84,32.46 v56.39,32.46
N$66  (via drill 0.35)
  Top 0.152: v60.96,40.39 60.81,40.54 60.81,43.13 U1.5 | v66.9,24.23 67.36,24.23 67.82,23.77 86.41,23.77 89,26.36 94.34,26.36 95.25,25.45 SV1.10
  Bottom 0.152: v60.96,40.39 67.97,33.38 67.97,25.3 v66.9,24.23
N$67  (via drill 0.35)
  Top 0.152: v66.45,57.15 66.45,58.37 U1.37 | v74.07,55.78 74.52,55.78 74.98,55.32 81.69,55.32 82.45,56.08 v90.07,56.08
  Bottom 0.152: v66.45,57.15 72.69,57.15 v74.07,55.78 | v90.07,56.08 91.44,56.08 92.2,56.84 93.12,56.84 94.18,55.78 94.18,55.47 95.25,54.41 95.56,54.41 98.3,51.66 98.3,39.78 95.1,36.58 94.79,36.58 93.73,35.51 93.73,35.2 92.51,33.98 92.2,33.98 91.75,33.53 91.75,28.96 92.66,28.04 SV1.11
N$68  (via drill 0.35)
  Top 0.152: v52.12,47.7 54.71,50.29 55.78,50.29 U1.57 | v48.62,39.32 48.62,35.81 52.43,32 53.19,32 55.78,29.41 55.78,14.48 56.24,14.02 79.86,14.02 85.19,19.36 93.12,19.36 93.73,19.96 93.73,21.95 92.81,22.86 SV1.7
  Bottom 0.152: v52.12,47.7 52.12,46.48 51.66,46.02 51.66,43.74 48.62,40.69 v48.62,39.32
N$69  (via drill 0.35)
  Top 0.152: v53.03,47.7 54.86,49.53 55.78,49.53 U1.58 | v49.68,40.39 49.68,38.71 51.05,37.34 51.05,35.81 51.97,34.9 52.58,34.9 56.08,31.39 56.08,14.63 56.39,14.33 79.7,14.33 85.65,20.27 92.66,20.27 SV1.5
  Bottom 0.152: v53.03,47.7 53.03,46.94 52.27,46.18 52.27,43.89 49.68,41.3 v49.68,40.39
N$70  (via drill 0.35)
  Top 0.152: v61.57,38.71 61.57,43.13 U1.6 | v64.77,26.36 65.68,26.36 67.67,24.38 v86.11,24.38
  Bottom 0.152: v61.57,38.71 64.77,35.51 64.77,30.02 63.25,28.5 63.25,27.89 v64.77,26.36 | v86.11,24.38 93.73,24.38 SV1.8
VCC
  Top 0.152: FB1.1 61.87,76.2 62.18,75.89 62.18,75.74 64.31,73.61 68.73,73.61 70.87,71.48 70.87,70.87 70.1,70.1 68.28,70.1 67.36,71.02 R1.1
  Bottom 0.152: 59.74,70.1 59.74,64.77 60.96,63.55 D1.C | 59.74,70.1 59.74,71.02 R4.2 | 59.74,70.1 65.08,70.1 65.99,71.02 67.21,71.02 R1.1 | 12.04,58.37 9.45,60.96 SV3.38 | 12.04,58.37 33.53,36.88 34.29,36.88 IC2.16 | 59.74,70.1 30.79,70.1 29.72,71.17 23.62,71.17 22.86,70.41 22.86,69.19 12.04,58.37